# Altium schematic sheet 双闪灯.SchDoc
size A4
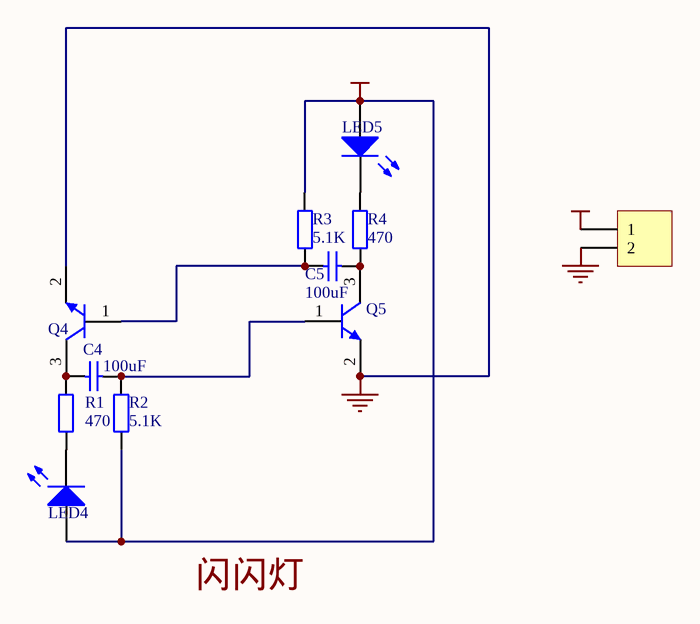
[diagram p0: 双闪灯.SchDoc]

## Parts
C4  value 100uF  [DJDR_5mm]  (hidden comment: Cap)
C5  value 100uF  [DJDR_5mm]  (hidden comment: Cap)
LED4  LED1  [LED]  (value not drawn)
LED5  LED1  [LED]  (value not drawn)
P?  Header 2  [HDR-2]  (value not drawn)
Q4  2N3904  [SANJG]  (value not drawn)
Q5  2N3904  [SANJG]  (value not drawn)
R1  value 470  [RSE]  (hidden comment: Res2)
R2  value 5.1K  [RSE]  (hidden comment: Res2)
R3  value 5.1K  [RSE]  (hidden comment: Res2)
R4  value 470  [RSE]  (hidden comment: Res2)

## Nets
GND: P?.2 Q4.2(E) Q5.2(E)
VCC: LED4.1(A) LED5.1(A) P?.1 R2.1 R3.2
NetC4_1: C4.1 Q4.3(C) R1.2
NetC4_2: C4.2 Q5.1(B) R2.2
NetC5_1: C5.1 Q4.1(B) R3.1
NetC5_2: C5.2 Q5.3(C) R4.1
NetLED4_2: LED4.2(K) R1.1
NetLED5_2: LED5.2(K) R4.2

## Notes on the sheet
- Labels drawn without touching a wire or pin: 闪闪灯

## Library data of the parts
C4 C5 = Cap: Capacitor; Published: 8-Jun-2000; LatestRevisionDate: 17-Jul-2002; LatestRevisionNote: Re-released for DXP Platform.; Publisher: Altium Limited
LED4 LED5 = LED1: Typical RED GaAs LED; Published: 8-Jun-2000; LatestRevisionDate: 17-Jul-2002; LatestRevisionNote: Re-released for DXP Platform.; Publisher: Altium Limited
P? = Header 2: Header, 2-Pin; LatestRevisionDate: 17-Jul-2002; LatestRevisionNote: Re-released for DXP Platform.; Publisher: Altium Limited
Q4 Q5 = 2N3904: NPN General Purpose Amplifier; Published: 8-Jun-2000; LatestRevisionDate: 15-Jan-2003; LatestRevisionNote: PCB Footprint 'BCY-W3/D4.7' replaced; DatasheetDocument: 1997; PackageReference: TO-92A; Publisher: Altium Limited; Code_JEDEC: TO-92A
R1-R4 = Res2: Resistor; Published: 8-Jun-2000; LatestRevisionDate: 17-Jul-2002; LatestRevisionNote: Re-released for DXP Platform.; Publisher: Altium Limited